# EAGLE design hvsupply (EAGLE 7.2.0)
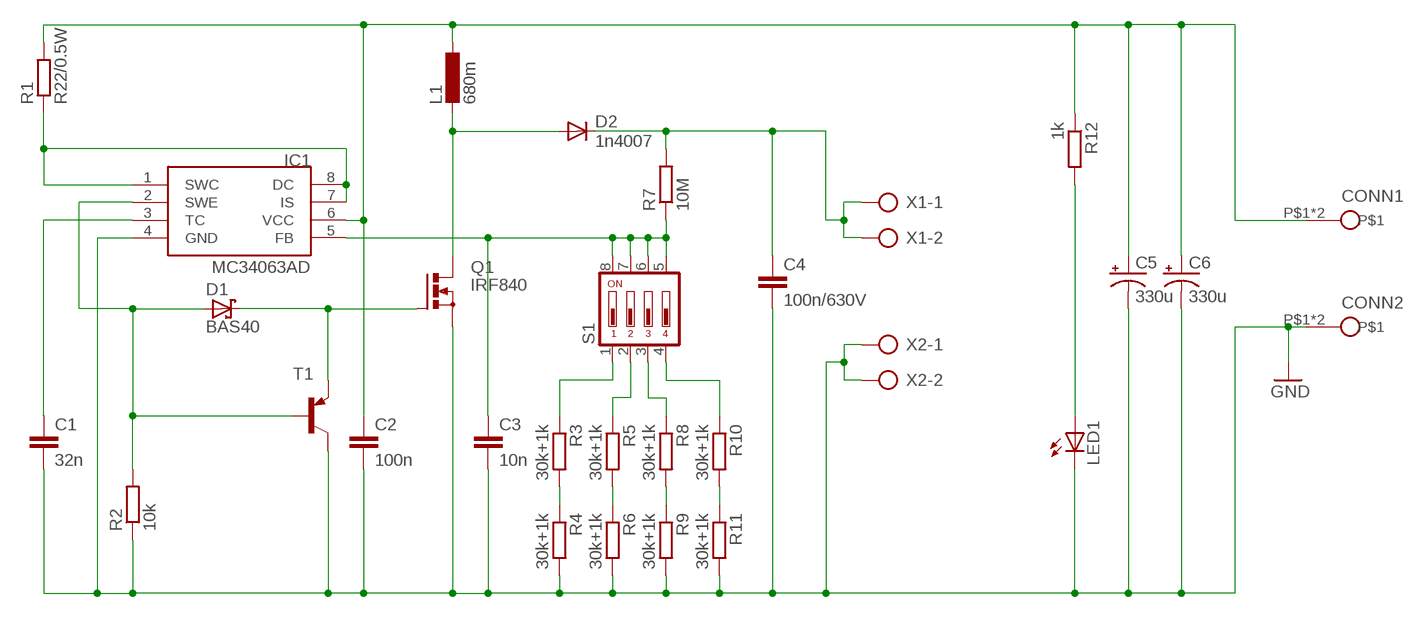
[diagram p0: schematic, sheet 1]

## Parts
11  BANANA-PLUG-2-PADS  [BANANA-PLUG-2-PADS]
12  BANANA-PLUG-2-PADS  [BANANA-PLUG-2-PADS]
C1  32n  C-EU025-025X050  [C025-025X050]
C2  100n  C-EUC3216  [C3216]
C3  10n  C-EUC3216  [C3216]
C4  100n/630V  C-EU102-064X133  [C102-064X133]
C5  330u  CPOL-USA/3216-18W  [A/3216-18W]
C6  330u  CPOL-USA/3216-18W  [A/3216-18W]
D1  BAS40  [SOT23]
D2  1n4007  1N4004  [DO41-10]
IC1  MC34063AD  [SOIC8]
L1  680m  L-EU0207/5V  [0207/5V]
LED1  LED3MM  [LED3MM]
Q1  IRF840  BUZ11BV  [TO220BV]
R1  R22/0.5W  R-EU_0207/5V  [0207/5V]
R2  10k  R-EU_R1206  [R1206]
R3  30k+1k  R-EU_R1206  [R1206]
R4  30k+1k  R-EU_R1206  [R1206]
R5  30k+1k  R-EU_R1206  [R1206]
R6  30k+1k  R-EU_R1206  [R1206]
R7  10M  R-EU_0207/5V  [0207/5V]
R8  30k+1k  R-EU_R1206  [R1206]
R9  30k+1k  R-EU_R1206  [R1206]
R10  30k+1k  R-EU_R1206  [R1206]
R11  30k+1k  R-EU_R1206  [R1206]
R12  1k  R-EU_R1206  [R1206]
S1  DS04  [DS-04]
T1  BC807-40-PNP-SOT23-BEC  [SOT23-BEC]
X1  AK500/2-H  [AK500/2-H]
X2  AK500/2-H  [AK500/2-H]

## Nets
GND: 12.P$1 12.P$2 C1.2 C2.2 C3.2 C4.2 C5.- C6.- IC1.4(GND) LED1.K(C) Q1.S R2.1 R4.2 R6.2 R9.2 R11.2 T1.C X2.1 X2.2
N$1: R8.2 R9.1
N$2: R5.2 R6.1
N$3: R3.2 R4.1
N$4: R10.2 R11.1
N$5: C1.1 IC1.3(TC)
N$6: R3.1 S1.1
N$7: R5.1 S1.2
N$8: R8.1 S1.3
N$9: R10.1 S1.4
N$10: LED1.A R12.2
N$11: IC1.1(SWC) IC1.7(IS) IC1.8(DC) R1.1
N$12: C3.1 IC1.5(FB) R7.1 S1.5 S1.6 S1.7 S1.8
N$14: D1.1(A) IC1.2(SWE) R2.2 T1.B
N$15 [hv]: D2.A L1.2 Q1.D
N$16: D1.3(C) Q1.G T1.E
N$18 [hv]: C4.1 D2.C R7.2 X1.1 X1.2
VCC: 11.P$1 11.P$2 C2.1 C5.+ C6.+ IC1.6(VCC) L1.1 R1.2 R12.1

## Library data of the parts
11 = banana-plug-2-pads:BANANA-PLUG-2-PADS: Two pads banana PCB socket.; PREFIX: CONN1
12 = banana-plug-2-pads:BANANA-PLUG-2-PADS: Two pads banana PCB socket.; PREFIX: CONN2
C1-C4 = resistor:C-EU: CAPACITOR, European symbol
C5 C6 = resistor:CPOL-US: POLARIZED CAPACITOR, American symbol
D1 = diode:BAS40: Silicon Schottky Diodes General-purpose diode for high-speed switching
D2 = diode:1N4004: DIODE general purpose rectifier, 1 A
IC1 = mc34063:MC34063
L1 = resistor:L-EU: INDUCTOR, European symbol
LED1 = led:LED: LED OSRAM: - CHIPLED LG R971, LG N971, LY N971, LG Q971, LY Q971, LO R971, LY R971 LH N974, LH R974 LS Q976, LO Q976, LY Q976 LO Q996 - Hyper CHIPLED LW Q18S LB Q993, LB Q99A, LB R99A - SideLED LS A670, LO A670, LY A670, LG A670, LP A670 LB A673, LV A673, LT A673, LW A673 LH A674 LY A675 LS A676, LA A676, LO A676, LY A676, LW A676 LS A679, LY A679, LG A679 - Hyper Micro SIDELED® LS Y876, LA Y876, LO Y876, LY Y876 LT Y87S - SmartLED LW L88C, LW L88S LB L89C, LB L89S, LG L890 LS L89K, LO L89K, LY L89K LS L896, LA L896, LO L896, LY L896 - TOPLED LS T670, LO T670, LY T670, LG T670, LP T670 LSG T670, LSP T670, LSY T670, LOP T670, LYG T670 LG T671, LOG T671, LSG T671 LB T673, LV T673, LT T673, LW T673 LH T674 LS T676, LA T676, LO T676, LY T676, LB T676, LH T676, LSB T676, LW T676 LB T67C, LV T67C, LT T67C, LS T67K, LO T67K, LY T67K, LW E67C LS E67B, LA E67B, LO E67B, LY E67B, LB E67C, LV E67C, LT E67C LW T67C LS T679, LY T679, LG T679 LS T770, LO T770, LY T770, LG T770, LP T770 LB T773, LV T773, LT T773, LW T773 LH T774 LS E675, LA E675, LY E675, LS T675 LS T776, LA T776, LO T776, LY T776, LB T776 LHGB T686 LT T68C, LB T68C - Hyper Mini TOPLED® LB M676 - Mini TOPLED Santana® LG M470 LS M47K, LO M47K, LY M47K Source: http://www.osram.convergy.de LUXEON: - LUMILED® LXK2-PW12-R00, LXK2-PW12-S00, LXK2-PW14-U00, LXK2-PW14-V00 LXK2-PM12-R00, LXK2-PM12-S00, LXK2-PM14-U00 LXK2-PE12-Q00, LXK2-PE12-R00, LXK2-PE12-S00, LXK2-PE14-T00, LXK2-PE14-U00 LXK2-PB12-K00, LXK2-PB12-L00, LXK2-PB12-M00, LXK2-PB14-N00, LXK2-PB14-P00, LXK2-PB14-Q00 LXK2-PR12-L00, LXK2-PR12-M00, LXK2-PR14-Q00, LXK2-PR14-R00 LXK2-PD12-Q00, LXK2-PD12-R00, LXK2-PD12-S00 LXK2-PH12-R00, LXK2-PH12-S00 LXK2-PL12-P00, LXK2-PL12-Q00, LXK2-PL12-R00 Source: www.luxeon.com KINGBRIGHT: KA-3528ASYC Source: www.kingbright.com
Q1 = transistor-power:BUZ11: N-CHANNEL MOS FET
R1-R12 = resistor:R-EU_: RESISTOR, European symbol
S1 = switch-dil:DS04: DIL/CODE SWITCH; OC_FARNELL: 9471570; OC_NEWARK: unknown
T1 = transistor:*-PNP-: PNP Transistror
X1 X2 = con-ptr500:AK500/2-H: CONNECTOR Aug. 2004 / PTR Meßtechnik: Die Bezeichnung der Serie AK505 wurde geändert. Es handelt sich hierbei um AK500 in horizontaler Ausführung.; OC_FARNELL: unknown; OC_NEWARK: unknown

## Net classes
1 hv: clearance 0.635 mm

## Board
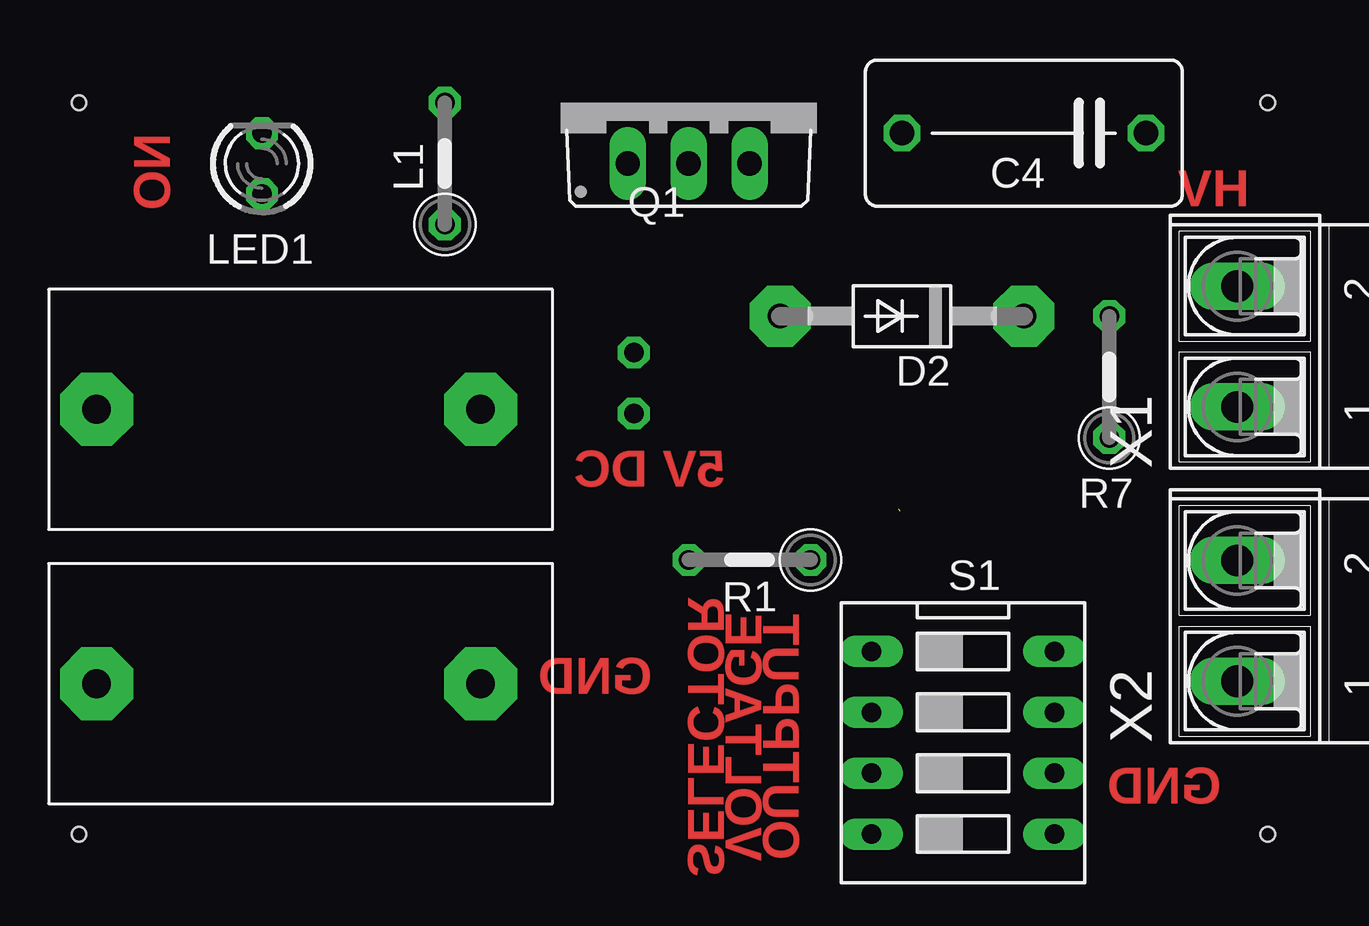
[diagram p1: board, top side]
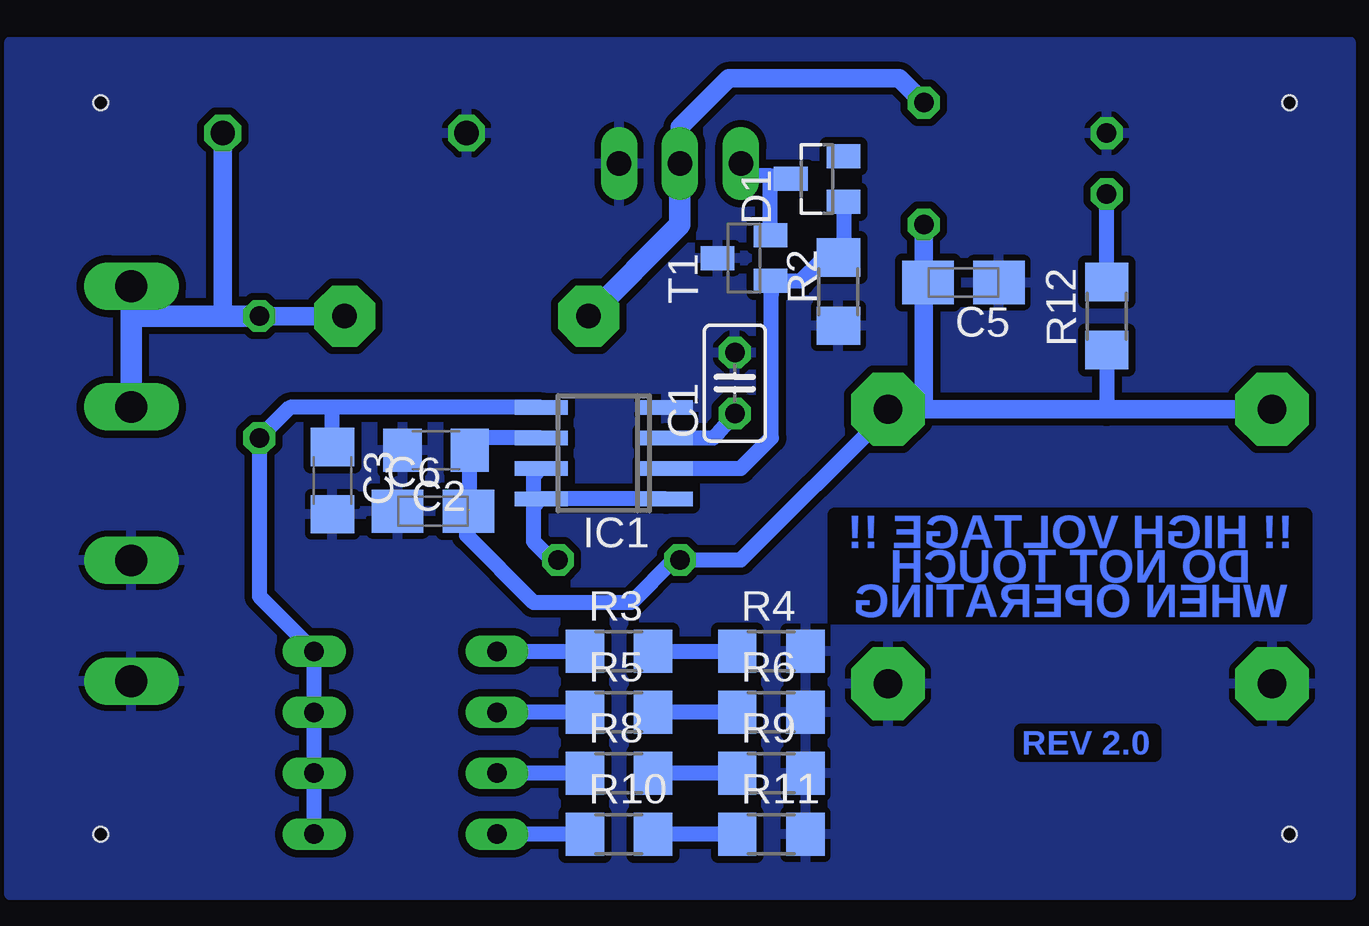
[diagram p2: board, bottom side, seen from below]

No outline drawn. Coordinates in mm, seen from the top.
Copper layers (1*16): Top 0.035mm / dielectric 1.5mm / Bottom 0.035mm
Design rules "default *": minimum track width 10mil, minimum drill 24mil, track to track 12mil, track to pad 15mil, pad to pad 8mil, via to via 8mil, smd to smd 8mil, copper to edge 0mil, drill to drill 8mil, minimum pad ring 10mil, minimum via ring 8mil, stop-mask expansion 4mil, vias tented up to drill 0mil, thermal gap 10mil
Holes 0.6 mm at 3.81,41.91 3.81,11.43 53.34,41.91 53.34,11.43

### Footprints (pad centres in the part's own frame; a part is rotated, then mirrored left to right if it is on the bottom)
BANANA-PLUG-2-PADS = drill 1.2 pad 3.048 octagon: P$1 7.84,-0.08; P$2 -8.16,-0.08
C025-025X050 = drill 0.813 octagon: 1 -1.27,0; 2 1.27,0
C3216 = smd 1.6 x 1.8: 1 -1.4,0; 2 1.4,0
C102-064X133 = drill 1.016 octagon: 1 -5.08,0; 2 5.08,0
A/3216-18W = smd 2.15 x 1.8: + 1.475,0; - -1.475,0
SOT23 = smd 1 x 1.4: 1 -0.95,-1.1; 2 0.95,-1.1; 3 0,1.1
DO41-10 = drill 1.016 pad 2.54 octagon: A 5.08,0; C -5.08,0
SOIC8 = smd 0.6 x 2.2: 1 -1.905,-2.6; 2 -0.635,-2.6; 3 0.635,-2.6; 4 1.905,-2.6; 5 1.905,2.6; 6 0.635,2.6; 7 -0.635,2.6; 8 -1.905,2.6
0207/5V = drill 0.813 octagon: 1 -2.54,0; 2 2.54,0
LED3MM = drill 0.813 octagon: A -1.27,0; K 1.27,0
TO220BV = drill 1.016 long: D 0,-2.54; G -2.54,-2.54; S 2.54,-2.54
R1206 = smd 1.6 x 1.803: 1 -1.422,0; 2 1.422,0
DS-04 = drill 0.813 long: 1 -3.81,-3.81; 2 -1.27,-3.81; 3 1.27,-3.81; 4 3.81,-3.81; 5 3.81,3.81; 6 1.27,3.81; 7 -1.27,3.81; 8 -3.81,3.81
SOT23-BEC = smd 1 x 1.4: B -0.95,-1.1; C 0,1.1; E 0.95,-1.1
AK500/2-H = drill 1.321 long: 1 -2.515,0; 2 2.515,0

### Placement (x,y rotation side)
11  12.7,29.21 0 top
12  12.7,17.78 0 top
C1  26.92,30.23 90 bottom
C2  39.37,27.43 180 bottom
C3  43.69,26.16 270 bottom
C4  43.18,40.64 180 top
C5  17.4,34.42 180 bottom
C6  39.5,24.89 0 bottom
D1  23.5,38.73 90 bottom
D2  38.1,33.02 180 top
IC1  32.38,27.3 90 bottom
L1  19.05,39.37 90 top
LED1  11.43,39.37 90 top
Q1  29.21,41.91 0 top
R1  31.75,22.86 180 top
R2  22.61,34.04 90 bottom
R3  31.75,19.05 0 bottom
R4  25.4,19.05 0 bottom
R5  31.75,16.51 0 bottom
R6  25.4,16.51 0 bottom
R7  46.74,30.48 90 top
R8  31.75,13.97 0 bottom
R9  25.4,13.97 0 bottom
R10  31.75,11.43 0 bottom
R11  25.4,11.43 0 bottom
R12  11.43,33.02 90 bottom
S1  40.64,15.24 270 top
T1  26.54,35.43 90 bottom
X1  52.07,31.75 90 top
X2  52.07,20.32 90 top

### Tracks (layer width: path | path; a pad name or v marks a point on that pad's centre or on a via)
GND
  pour Bottom: 1.27,8.89 57.15,8.89 57.15,44.45 1.27,44.45
N$1
  Bottom 0.635: R9.1 R8.2
N$2
  Bottom 0.635: R6.1 R5.2
N$3
  Bottom 0.635: R3.2 R4.1
N$4
  Bottom 0.635: R11.1 R10.2
N$5
  Bottom 0.635: IC1.3 27.81,27.94 C1.1
N$6
  Bottom 0.635: S1.1 R3.1
N$7
  Bottom 0.635: R5.1 S1.2
N$8
  Bottom 0.635: R8.1 S1.3
N$9
  Bottom 0.635: R10.1 S1.4
N$10
  Bottom 0.635: R12.2 LED1.A
N$11
  Bottom 0.635: R1.1 34.54,22.86 35.31,23.62 35.31,25.08 IC1.8 | IC1.8 35.31,25.4 35.31,26.35 IC1.7 | IC1.1 IC1.8
N$12
  Bottom 0.635: S1.5 S1.6 S1.7 S1.8 46.74,21.34 R7.1 45.47,29.21 43.69,29.21 | 34.92,29.21 IC1.5 43.69,29.21 | C3.1 43.69,29.21
N$14
  Bottom 0.635: IC1.2 26.67,26.67 25.4,27.94 25.4,33.93 T1.B 24.19,34.48 23.37,35.31 22.76,35.31 R2.2 22.39,35.67 D1.1
N$15
  Bottom 0.762: L1.2 20.07,42.93 27.18,42.93 29.21,40.89 Q1.D
  Bottom 0.889: Q1.D 29.21,36.83 D2.A
N$16
  Bottom 0.635: T1.E 25.44,38.82 25.4,38.86 | 25.4,38.86 26.16,38.86 Q1.G | D1.3 25.27,38.73 25.4,38.86
N$18
  Bottom 0.762: D2.C R7.2 48.26,33.02 C4.1
  Bottom 0.889: X1.1 52.07,33.02 | 52.07,33.02 X1.2 | R7.2 52.07,33.02
VCC  (1 unrouted)
  Bottom 0.635: R12.1 11.43,29.13 | 37.97,24.97 C2.1 37.46,27.94 IC1.6 | C5.+ 19.05,33.91 | C6.+ 38.1,24.81 38.1,23.88 35.31,21.08 31.24,21.08 29.46,22.86 R1.2 26.67,22.86 20.54,28.99 11.P$1
  Bottom 0.762: 11.P$2 11.43,29.13 19.05,29.13 | 19.05,29.13 11.P$1 | L1.1 19.05,33.91 19.05,29.13

### Text on the board
Top: ON | HV | 5V DC | GND | OUTPPUT / VOLTAGE / SELECTOR | GND
Bottom: !! HIGH VOLTAGE !! / DO NOT TOUCH / WHEN OPERATING | REV 2.0